# EAGLE schematic VSCard_v4 (EAGLE 8.3.1)
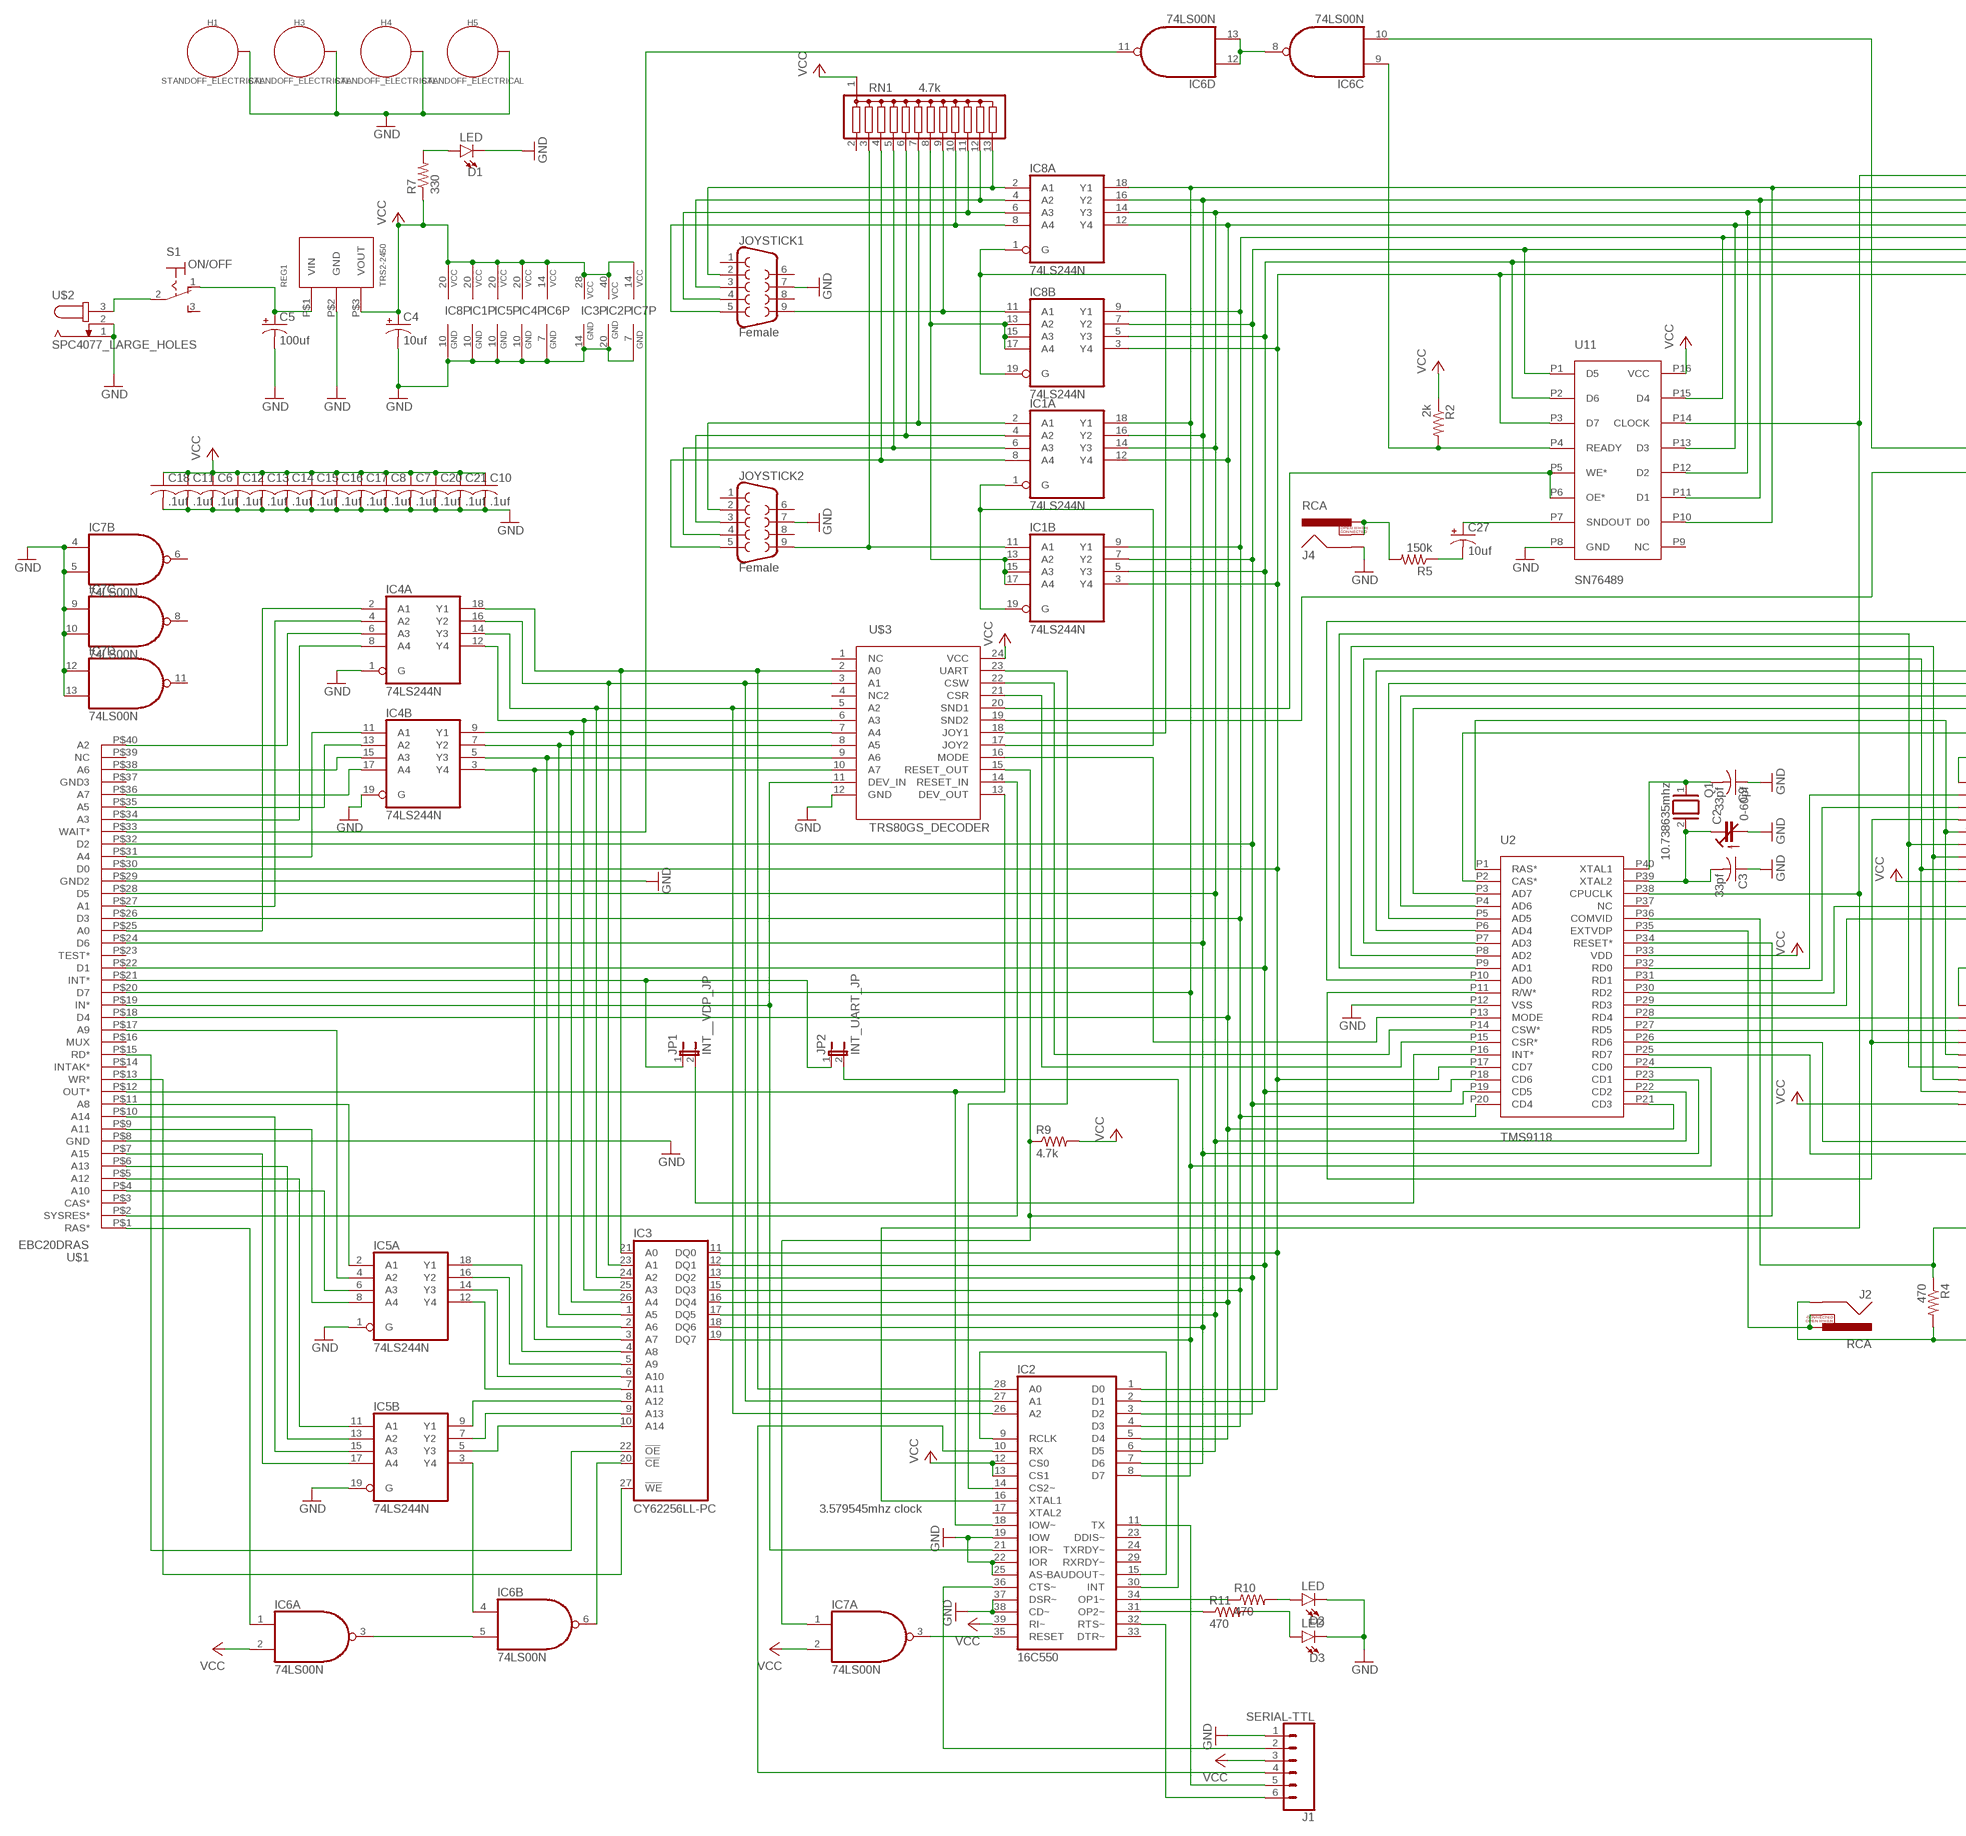
[diagram p0: schematic, sheet 1, part 1 of 2]
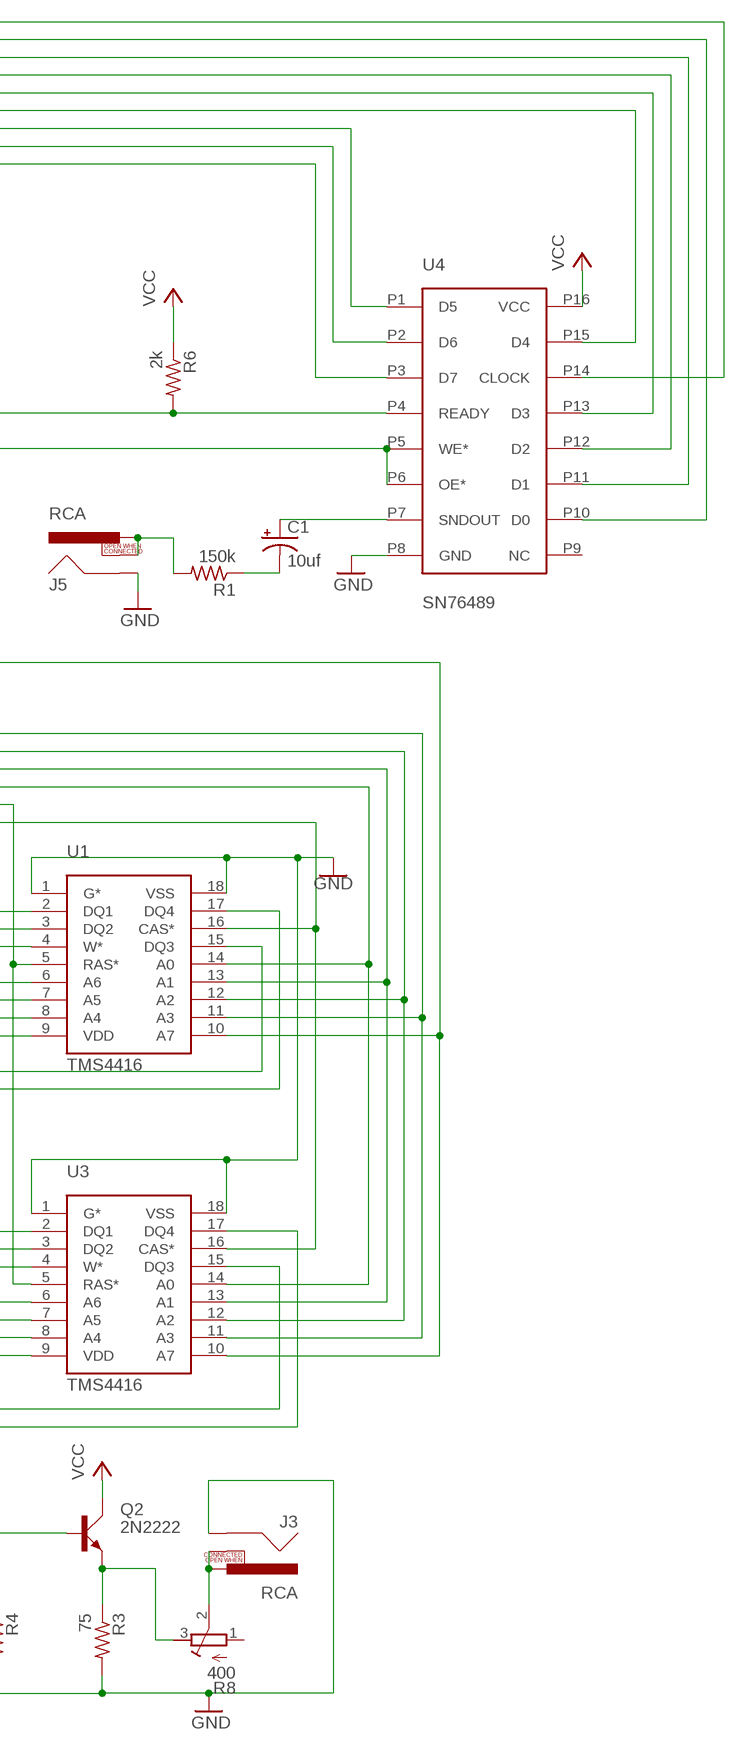
[diagram p1: schematic, sheet 1, part 2 of 2]

## Parts
C1  10uf  CPOL-USE2.5-6  [E2,5-6]
C2  0-60pf  C-TRIMM3050.504  [CTRIM3050.504]
C3  33pf  C-US050-050X075  [C050-050X075]
C4  10uf  CPOL-USE2.5-5  [E2,5-5]
C5  100uf  CPOL-USE3.5-10  [E3,5-10]
C6  .1uf  C-US025-025X050  [C025-025X050]
C7  .1uf  C-US025-025X050  [C025-025X050]
C8  .1uf  C-US025-025X050  [C025-025X050]
C9  33pf  C-US050-050X075  [C050-050X075]
C10  .1uf  C-US025-025X050  [C025-025X050]
C11  .1uf  C-US025-025X050  [C025-025X050]
C12  .1uf  C-US025-025X050  [C025-025X050]
C13  .1uf  C-US025-025X050  [C025-025X050]
C14  .1uf  C-US025-025X050  [C025-025X050]
C15  .1uf  C-US025-025X050  [C025-025X050]
C16  .1uf  C-US025-025X050  [C025-025X050]
C17  .1uf  C-US025-025X050  [C025-025X050]
C18  .1uf  C-US025-025X050  [C025-025X050]
C20  .1uf  C-US025-025X050  [C025-025X050]
C21  .1uf  C-US025-025X050  [C025-025X050]
C27  10uf  CPOL-USE2.5-6  [E2,5-6]
D1  LED  LED3MM  [LED_3MM]
D2  LED  LED3MM  [LED_3MM]
D3  LED  LED3MM  [LED_3MM]
H1  STANDOFF_ELECTRICAL  [STANDOFF-ELECTRICAL]
H3  STANDOFF_ELECTRICAL  [STANDOFF-ELECTRICAL]
H4  STANDOFF_ELECTRICAL  [STANDOFF-ELECTRICAL]
H5  STANDOFF_ELECTRICAL  [STANDOFF-ELECTRICAL]
IC1  74LS244N  [DIL20]
IC2  16C550  XR-16C550P  [DIL40]
IC3  CY62256LL-PC  [DIL28-6]
IC4  74LS244N  [DIL20]
IC5  74LS244N  [DIL20]
IC6  74LS00N  [DIL14]
IC7  74LS00N  [DIL14]
IC8  74LS244N  [DIL20]
J1  SERIAL-TTL  CONN_06NO_SILK_FEMALE_PTH  [1X06_NO_SILK]
J2  RCA  [RCA]
J3  RCA  [RCA]
J4  RCA  [RCA]
J5  RCA  [RCA]
JOYSTICK1  Female  DB9FEMALE  [DB9]
JOYSTICK2  Female  DB9FEMALE  [DB9]
JP1  INT__VDP_JP  JP1E  [JP1]
JP2  INT_UART_JP  JP1E  [JP1]
Q1  10.738635mhz  XTAL/S  [QS]
Q2  2N2222  [TO18A]
R1  150k  R-US_0207/2V  [0207/2V]
R2  2k  R-US_0207/2V  [0207/2V]
R3  75  R-US_0207/2V  [0207/2V]
R4  470  R-US_0207/2V  [0207/2V]
R5  150k  R-US_0207/2V  [0207/2V]
R6  2k  R-US_0207/2V  [0207/2V]
R7  330  R-US_0309/V  [0309V]
R8  400  R-TRIMM64W  [RTRIM64W]
R9  4.7k  R-US_0207/2V  [0207/2V]
R10  470  R-US_0207/2V  [0207/2V]
R11  470  R-US_0207/2V  [0207/2V]
REG1  TRS2-2450  [TRACON_REG]
RN1  4.7k  G12R  [SIL13]
S1  ON/OFF  320-916  [320-916]
U1  TMS4416  [DIP18]
U2  TMS9118  [DIP40_MCU]
U3  TMS4416  [DIP18]
U4  SN76489  [DIP16]
U11  SN76489  [DIP16]
U$1  EBC20DRAS  [EBC20DRAS]
U$2  SPC4077_LARGE_HOLES  [SPC4077]
U$3  TRS80GS_DECODER  [DIP24SKI]

## Nets
A0_BUFFERED: IC2.28(A0) IC3.21(A0) IC4.18(A:Y1) U$3.2(A0)
A0_RAW: IC4.2(A:A1) U$1.P$25(A0)
A1_BUFFERED: IC2.27(A1) IC3.23(A1) IC4.16(A:Y2) U$3.3(A1)
A1_RAW: IC4.4(A:A2) U$1.P$27(A1)
A2_BUFFERED: IC2.26(A2) IC3.24(A2) IC4.14(A:Y3) U$3.5(A2)
A2_RAW: IC4.6(A:A3) U$1.P$40(A2)
A3_BUFFERED: IC3.25(A3) IC4.12(A:Y4) U$3.6(A3)
A3_RAW: IC4.8(A:A4) U$1.P$34(A3)
A4_BUFFERED: IC3.26(A4) IC4.9(B:Y1) U$3.7(A4)
A4_RAW: IC4.11(B:A1) U$1.P$31(A4)
A5_BUFFERED: IC3.1(A5) IC4.7(B:Y2) U$3.8(A5)
A5_RAW: IC4.13(B:A2) U$1.P$35(A5)
A6_BUFFERED: IC3.2(A6) IC4.5(B:Y3) U$3.9(A6)
A6_RAW: IC4.15(B:A3) U$1.P$38(A6)
A7_BUFFERED: IC3.3(A7) IC4.3(B:Y4) U$3.10(A7)
A7_RAW: IC4.17(B:A4) U$1.P$36(A7)
A8_BUFFERED: IC3.4(A8) IC5.18(A:Y1)
A8_RAW: IC5.2(A:A1) U$1.P$11(A8)
A9_BUFFERED: IC3.5(A9) IC5.16(A:Y2)
A9_RAW: IC5.4(A:A2) U$1.P$17(A9)
A10_BUFFERED: IC3.6(A10) IC5.14(A:Y3)
A10_RAW: IC5.6(A:A3) U$1.P$4(A10)
A11_BUFFERED: IC3.7(A11) IC5.12(A:Y4)
A11_RAW: IC5.8(A:A4) U$1.P$9(A11)
A12_BUFFERED: IC3.8(A12) IC5.9(B:Y1)
A12_RAW: IC5.11(B:A1) U$1.P$5(A12)
A13_BUFFERED: IC3.9(A13) IC5.7(B:Y2)
A13_RAW: IC5.13(B:A2) U$1.P$6(A13)
A14_BUFFERED: IC3.10(A14) IC5.5(B:Y3)
A14_RAW: IC5.15(B:A3) U$1.P$10(A14)
A15_BUFFERED: IC5.3(B:Y4) IC6.4(B:I0)
A15_RAW: IC5.17(B:A4) U$1.P$7(A15)
COMVID: Q2.B R4.1 U2.P36(COMVID)
COMVID-OUT: Q2.E R3.1 R8.3(E)
CTS*: IC2.36(CTS~) J1.2
D0: IC1.3(B:Y4) IC2.1(D0) IC3.11(DQ0) IC8.3(B:Y4) U2.P17(CD7) U4.P3(D7) U11.P3(D7) U$1.P$30(D0)
D1: IC1.5(B:Y3) IC2.2(D1) IC3.12(DQ1) IC8.5(B:Y3) U2.P18(CD6) U4.P2(D6) U11.P2(D6) U$1.P$22(D1)
D2: IC1.7(B:Y2) IC2.3(D2) IC3.13(DQ2) IC8.7(B:Y2) U2.P19(CD5) U4.P1(D5) U11.P1(D5) U$1.P$32(D2)
D3: IC1.9(B:Y1) IC2.4(D3) IC3.15(DQ3) IC8.9(B:Y1) U2.P20(CD4) U4.P15(D4) U11.P15(D4) U$1.P$26(D3)
D4: IC1.12(A:Y4) IC2.5(D4) IC3.16(DQ4) IC8.12(A:Y4) U2.P21(CD3) U4.P13(D3) U11.P13(D3) U$1.P$18(D4)
D5: IC1.14(A:Y3) IC2.6(D5) IC3.17(DQ5) IC8.14(A:Y3) U2.P22(CD2) U4.P12(D2) U11.P12(D2) U$1.P$28(D5)
D6: IC1.16(A:Y2) IC2.7(D6) IC3.18(DQ6) IC8.16(A:Y2) U2.P23(CD1) U4.P11(D1) U11.P11(D1) U$1.P$24(D6)
D7: IC1.18(A:Y1) IC2.8(D7) IC3.19(DQ7) IC8.18(A:Y1) U2.P24(CD0) U4.P10(D0) U11.P10(D0) U$1.P$20(D7)
DOWN: IC8.4(A:A2) JOYSTICK1.3 RN1.12
DOWN1: IC1.4(A:A2) JOYSTICK2.3 RN1.6
GND: C2.2(A) C3.1 C4.- C5.- C6.2 C7.2 C8.2 C9.1 C10.2 C11.2 C12.2 C13.2 C14.2 C15.2 C16.2 C17.2 C18.2 C20.2 C21.2 D1.K(C) D2.K(C) D3.K(C) H1.P1 H3.P1 H4.P1 H5.P1 IC1.10(P:GND) IC2.19(IOW) IC2.20(GND) IC2.22(IOR) IC2.25(AS~) IC2.37(DSR~) IC2.38(CD~) IC3.14(GND) IC4.1(A:G) IC4.10(P:GND) IC4.19(B:G) IC5.1(A:G) IC5.10(P:GND) IC5.19(B:G) IC6.7(P:GND) IC7.4(B:I0) IC7.5(B:I1) IC7.7(P:GND) IC7.9(C:I0) IC7.10(C:I1) IC7.12(D:I0) IC7.13(D:I1) IC8.10(P:GND) J1.1 J2.SHELL J3.SHELL J4.SHELL J5.SHELL JOYSTICK1.7 JOYSTICK2.7 R3.2 R4.2 REG1.P$2(GND) U1.1(G*) U1.18(VSS) U2.P12(VSS) U3.1(G*) U3.18(VSS) U4.P8(GND) U11.P8(GND) U$1.P$8(GND) U$1.P$29(GND2) U$2.1 U$2.2 U$3.12(GND)
IN*: IC2.21(IOR~) U$1.P$19(IN*) U$3.11(DEV_IN)
INT*: JP1.1 JP2.1 U$1.P$21(INT*)
JOY1_IN_ENABLE_N: IC8.1(A:G) IC8.19(B:G) U$3.18(JOY1)
JOY1_IN_ENABLE_N1: IC1.1(A:G) IC1.19(B:G) U$3.17(JOY2)
LEFT: IC8.6(A:A3) JOYSTICK1.4 RN1.11
LEFT1: IC1.6(A:A3) JOYSTICK2.4 RN1.5
N$1: J4.PIN J4.SWITCH R5.2
N$2: S1.2(P) U$2.3
N$3: JP1.2 U2.P16(INT*)
N$4: J3.PIN J3.SWITCH R8.2(S)
N$5: IC2.30(INT) JP2.2
N$6: IC2.14(CS2~) U$3.23(UART)
N$7: IC2.35(RESET) IC7.3(A:O)
N$8: IC2.34(OP1~) R10.1
N$9: IC2.31(OP2~) R11.1
N$10: D2.A R10.2
N$11: D3.A R11.2
N$14: U2.P14(CSW*) U$3.22(CSW)
N$15: U2.P15(CSR*) U$3.21(CSR)
N$16: C2.1(E) C3.2 Q1.2 U2.P39(XTAL2)
N$17: J2.PIN J2.SWITCH U2.P35(EXTVDP)
N$18: U1.5(RAS*) U2.P1(RAS*) U3.5(RAS*)
N$20: D1.A R7.2
N$21: U1.16(CAS*) U2.P2(CAS*) U3.16(CAS*)
N$23: IC2.9(RCLK) IC2.15(BAUDOUT~)
N$24: J5.PIN J5.SWITCH R1.2
N$37: IC6.1(A:I0) U$1.P$1(RAS*)
N$39: IC6.3(A:O) IC6.5(B:I1)
N$40: IC3.20(!CE) IC6.6(B:O)
N$41: IC6.8(C:O) IC6.12(D:I0) IC6.13(D:I1)
N$64: C27.- R5.1
N$94: C1.- R1.1
N$99: IC1.13(B:A2) IC1.15(B:A3) IC1.17(B:A4) IC8.13(B:A2) IC8.15(B:A3) IC8.17(B:A4) RN1.8
OUT*: IC2.18(IOW~) U$1.P$12(OUT*) U$3.13(DEV_OUT)
RD_: IC3.22(!OE) U$1.P$15(RD*)
RIGHT: IC8.8(A:A4) JOYSTICK1.5 RN1.10
RIGHT1: IC1.8(A:A4) JOYSTICK2.5 RN1.4
RTS*: IC2.32(RTS~) J1.6
SIN: IC2.10(RX) J1.4
SN76489-CLOCK: IC2.16(XTAL1) U2.P38(CPUCLK) U4.P14(CLOCK) U11.P14(CLOCK)
SND1_ENABLE_N: U11.P5(WE*) U11.P6(OE*) U$3.20(SND1)
SND1_READY: IC6.9(C:I0) R2.2 U11.P4(READY)
SND2_ENABLE_N: U4.P5(WE*) U4.P6(OE*) U$3.19(SND2)
SND2_READY: IC6.10(C:I1) R6.2 U4.P4(READY)
SNDOUT1: C27.+ U11.P7(SNDOUT)
SNDOUT2: C1.+ U4.P7(SNDOUT)
SOUT: IC2.11(TX) J1.5
SYSRESET*: U$1.P$2(SYSRES*) U$3.14(RESET_IN)
TMS9118_RW(*)_TMS4416_W(*): U1.4(W*) U2.P11(R/W*) U3.4(W*)
TMS9918_AD0-TMS4416_A7: U1.10(A7) U2.P10(AD0) U3.10(A7)
TMS9918_AD1-TMS4416_A6: U1.6(A6) U2.P9(AD1) U3.6(A6)
TMS9918_AD2-TMS4416_A5: U1.7(A5) U2.P8(AD2) U3.7(A5)
TMS9918_AD3-TMS4416_A4: U1.8(A4) U2.P7(AD3) U3.8(A4)
TMS9918_AD4-TMS4416_A3: U1.11(A3) U2.P6(AD4) U3.11(A3)
TMS9918_AD5-TMS4416_A2: U1.12(A2) U2.P5(AD5) U3.12(A2)
TMS9918_AD6-TMS4416_A1: U1.13(A1) U2.P4(AD6) U3.13(A1)
TMS9918_AD7-TMS4416_A0: U1.14(A0) U2.P3(AD7) U3.14(A0)
TRIGGER: IC8.11(B:A1) JOYSTICK1.9 RN1.9
TRIGGER1: IC1.11(B:A1) JOYSTICK2.9 RN1.3
UP: IC8.2(A:A1) JOYSTICK1.2 RN1.13
UP1: IC1.2(A:A1) JOYSTICK2.2 RN1.7
VCC: C4.+ C6.1 C7.1 C8.1 C10.1 C11.1 C12.1 C13.1 C14.1 C15.1 C16.1 C17.1 C18.1 C20.1 C21.1 IC1.20(P:VCC) IC2.12(CS0) IC2.13(CS1) IC2.39(RI~) IC2.40(VCC) IC3.28(VCC) IC4.20(P:VCC) IC5.20(P:VCC) IC6.2(A:I1) IC6.14(P:VCC) IC7.2(A:I1) IC7.14(P:VCC) IC8.20(P:VCC) J1.3 Q2.C R2.1 R6.1 R7.1 R9.2 REG1.P$3(VOUT) RN1.1 U1.9(VDD) U2.P33(VDD) U3.9(VDD) U4.P16(VCC) U11.P16(VCC) U$3.24(VCC)
VDP-RD0: U1.2(DQ1) U2.P32(RD0)
VDP-RD1: U1.3(DQ2) U2.P31(RD1)
VDP-RD2: U1.15(DQ3) U2.P30(RD2)
VDP-RD3: U1.17(DQ4) U2.P29(RD3)
VDP-RD4: U2.P28(RD4) U3.2(DQ1)
VDP-RD5: U2.P27(RD5) U3.3(DQ2)
VDP-RD6: U2.P26(RD6) U3.15(DQ3)
VDP-RD7: U2.P25(RD7) U3.17(DQ4)
VDP_MODE: U2.P13(MODE) U$3.16(MODE)
VID_RESET*: IC7.1(A:I0) R9.1 U2.P34(RESET*) U$3.15(RESET_OUT)
VOLTAGE-IN: C5.+ REG1.P$1(VIN) S1.1(O)
WAIT*: IC6.11(D:O) U$1.P$33(WAIT*)
WR_: IC3.27(!WE) U$1.P$13(WR*)
XTAL1: C9.2 Q1.1 U2.P40(XTAL1)
Unconnected: IC2.17(XTAL2) IC2.23(DDIS~) IC2.24(TXRDY~) IC2.29(RXRDY~) IC2.33(DTR~) IC7.6(B:O) IC7.8(C:O) IC7.11(D:O) JOYSTICK1.1 JOYSTICK1.6 JOYSTICK1.8 JOYSTICK2.1 JOYSTICK2.6 JOYSTICK2.8 R8.1(A) RN1.2 S1.3(S) U2.P37(NC) U4.P9(NC) U11.P9(NC) U$1.P$3(CAS*) U$1.P$14(INTAK*) U$1.P$16(MUX) U$1.P$23(TEST*) U$1.P$37(GND3) U$1.P$39(NC) U$3.1(NC) U$3.4(NC2)

## Notes on the sheet
- 3.579545mhz clock

## Library data of the parts
C1 C4 C27 = resistor:CPOL-US: POLARIZED CAPACITOR, American symbol
C2 = rcl:C-TRIMM: Trimm capacitor
C3 C9 = rcl:C-US: CAPACITOR, American symbol
C5 = rcl:CPOL-US: POLARIZED CAPACITOR, American symbol
C6-C8 C10-C18 C20 C21 = resistor:C-US: CAPACITOR, American symbol
D1-D3 = SparkFun-LED:LED: LED (Generic) Standard schematic elements and footprints for 5mm, 3mm, 1206, and 0603 sized LEDs. Generic LEDs with no color specified.; PROD_ID: DIO-08794
H1 H3-H5 = SparkFun-Hardware:STANDOFF_ELECTRICAL: Stand Off Drill holes with an electrical connection. For example, use these to ground your board to a chassis. Example SparkFun Products Screw - Phillips Head (1/4", 4-40, 10 pack) <https://www.sparkfun.com/products/10453> (PRT-10453) Screw - Phillips Head (1/2", 4-40, 10 pack) <https://www.sparkfun.com/products/10452> (PRT-10452) Screw - Phillips Head (3/4", 4-40, 10 pack) <https://www.sparkfun.com/products/10451> (PRT-10451) Screw - Phillips Head (1", 4-40, 10 pack) <https://www.sparkfun.com/products/10450> (PRT-10450)
IC1 IC4 IC5 IC8 = 74xx-us:74*244: Octal BUFFER and LINE DRIVER, 3-state
IC2 = exar:XR-16C550P: UART/FIFO; MPN: ST16C450CP40; OC_FARNELL: 1294801; OC_NEWARK: 24R1445
IC3 = memory-sram:CY62256LL-?*: 256K (32K x 8) CMOS-Static RAM Source: http://download.cypress.com.edgesuite.net/design_resources/datasheets/contents/cy62256_8.pdf
IC6 IC7 = 74xx-us:74*00: Quad 2-input NAND gate
J1 = SparkFun-Connectors:CONN_06: Multi connection point. Often used as Generic Header-pin footprint for 0.1 inch spaced/style header connections On any of the 0.1 inch spaced packages, you can populate with these: Break Away Headers - Straight <https://www.sparkfun.com/products/116> (PRT-00116) Break Away Male Headers - Right Angle <https://www.sparkfun.com/products/553> (PRT-00553) Female Headers <https://www.sparkfun.com/products/115> (PRT-00115) Break Away Headers - Machine Pin <https://www.sparkfun.com/products/117> (PRT-00117) Break Away Female Headers - Swiss Machine Pin <https://www.sparkfun.com/products/743> (PRT-00743) Arduino Stackable Header - 6 Pin <https://www.sparkfun.com/products/9280> (PRT-09280) For SCREWTERMINALS and SPRING TERMINALS visit here: Screw Terimnals on SparkFun.com <https://www.sparkfun.com/search/results?term=Screw+Terminals> (5mm/3.5mm/2.54mm spacing) This device is also useful as a general connection point to wire up your design to another part of your project. Our various solder wires solder well into these plated through hole pads. Hook-Up Wire - Assortment (Stranded, 22 AWG) <https://www.sparkfun.com/products/11375> (PRT-11375) Hook-Up Wire - Assortment (Solid Core, 22 AWG) <https://www.sparkfun.com/products/11367> (PRT-11367) View the entire wire category on our website here <https://www.sparkfun.com/categories/141>; PROD_ID: CONN-08437
J2-J5 = SparkFun-Connectors:RCA: RCA Jack connector This is a right angle RCA jack connecotr. Commonly used for video or audio. Here is the connector we sell at SparkFun: RCA Jack <https://www.sparkfun.com/products/8631> (PRT-08631) Datasheet <http://www.sparkfun.com/datasheets/Prototyping/Connectors/RCA-Jack.pdf> It is not used on any active designs, however it was used on a couple retired products: RCA Jack Breakout [RETIRED] <https://www.sparkfun.com/products/8826> (PRT-08826) SparkFun On Screen Display Breakout - MAX7456 [RETIRED] <https://www.sparkfun.com/products/9168> (BOB-09168) You may also be interested in a cable: RCA Video Cable - 6' <https://www.sparkfun.com/products/11573> (CAB-11573); PROD_ID: CONN-09081; SF_ID: PRT-08631
JOYSTICK1 JOYSTICK2 = SparkFun-Connectors:DB9: DB9 Connector Standard DB9 (D-Sub 9) serial connector. Can be used for CAN bus as well as RS485 and RS232. Footprint production proven. Here is the female version connector we sell at SparkFun: 9 Pin Female Serial Connector - PCB Mount <https://www.sparkfun.com/products/429> (PRT-00429) This connector has been used on the following SparkFun products: SparkFun RS232 Shifter - SMD <https://www.sparkfun.com/products/449> (PRT-00449) SparkFun RS232 Shifter SMD (No DB9) <https://www.sparkfun.com/products/8780> (PRT-08780); PROD_ID: CONN-08194
JP1 JP2 = jumper:JP1E: JUMPER
Q1 = special:XTAL/S: CRYSTAL
Q2 = transistor-small-signal:2N2222: NPN TRANSISTOR
R1-R7 R9-R11 = resistor:R-US_: RESISTOR, American symbol
R8 = resistor:R-TRIMM: Trimm resistor
REG1 = TMS99:TRS2-2450: 5V TRACO regulator
RN1 = resistor-sil:G12R: SIL RESISTOR; OC_FARNELL: unknown; OC_NEWARK: unknown
S1 = switch:320-916: TOGGLE SWITCH distributor RS Components
U1 U3 = TMS99:TMS4416: TMS4416
U2 = TMS99:TMS9118: TMS9118
U4 U11 = TMS99:SN76489: SN76489 Sound Chip
U$1 = TMS99:EBC20DRAS
U$2 = con-jack:SPC4077_LARGE_HOLES
U$3 = TMS99:TRS80GS_DECODER